# Altium schematic sheet serial_com.SchDoc
size A4
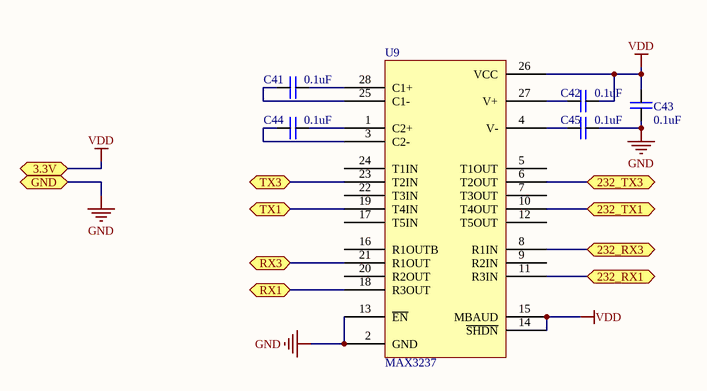
[diagram p0: serial_com.SchDoc]

## Parts
C41  value 0.1uF  [CAP-0805]  (hidden comment: CAP)
C42  value 0.1uF  [CAP-0805]  (hidden comment: CAP)
C43  value 0.1uF  [CAP-0805]  (hidden comment: CAP)
C44  value 0.1uF  [CAP-0805]  (hidden comment: CAP)
C45  value 0.1uF  [CAP-0805]  (hidden comment: CAP)
U9  MAX3237  [SSOP28]

## Ports
3.3V, 232_RX1, 232_RX3, 232_TX1, 232_TX3, GND, RX1, RX3, TX1, TX3

## Nets
GND: C43.1 C45.2 U9.2(GND) U9.13(~{EN}) ; port GND
VDD: C42.2 C43.2 U9.14(~{SHDN}) U9.15(MBAUD) U9.26(VCC) ; port 3.3V
232_RX1: U9.11(R3IN) ; port 232_RX1
232_RX3: U9.8(R1IN) ; port 232_RX3
232_TX1: U9.10(T4OUT) ; port 232_TX1
232_TX3: U9.6(T2OUT) ; port 232_TX3
RX1: U9.18(R3OUT) ; port RX1
RX3: U9.21(R1OUT) ; port RX3
TX1: U9.19(T4IN) ; port TX1
TX3: U9.23(T2IN) ; port TX3
NetC41_1: C41.1 U9.25(C1-)
NetC41_2: C41.2 U9.28(C1+)
NetC42_1: C42.1 U9.27(V+)
NetC44_1: C44.1 U9.3(C2-)
NetC44_2: C44.2 U9.1(C2+)
NetC45_1: C45.1 U9.4(V-)

Not connected (* = marked no-connect by the designer): U9 5(T1OUT) 7(T3OUT) 9(R2IN) 12(T5OUT) 16(R1OUTB) 17(T5IN) 20(R2OUT) 22(T3IN) 24(T1IN)